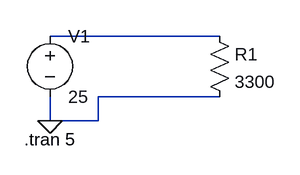
[diagram p0: schematic Simulation_2.asc]
Simulation_2.asc, the LTspice schematic file:
Version 4
SHEET 1 880 680
WIRE 304 112 80 112
WIRE 304 192 144 192
WIRE 80 224 80 192
WIRE 144 224 144 192
WIRE 144 224 80 224
FLAG 80 224 0
SYMBOL voltage 80 96 R0
WINDOW 123 0 0 Left 0
WINDOW 39 0 0 Left 0
SYMATTR InstName V1
SYMATTR Value 25
SYMBOL res 288 96 R0
SYMATTR InstName R1
SYMATTR Value 3300
TEXT 46 248 Left 2 !.tran 5

The netlist it stands for:
* Simulation_2.asc
V1 N001 0 25
R1 N001 0 3300
.tran 5
.backanno
.end